# Altium schematic sheet AT24Cxxx_EEPROM_I2C.SchDoc
size A; SheetNumber: 5; SheetTotal: 12
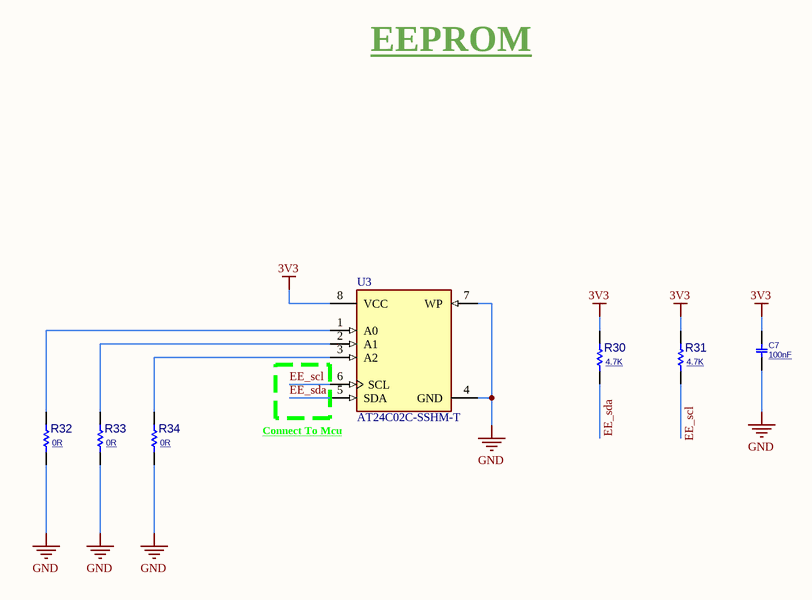
[diagram p0: AT24Cxxx_EEPROM_I2C.SchDoc]

## Parts
C7  100nF  [C0603]
R30  4.7K  [R0603]
R31  4.7K  [R0603]
R32  0R  [R0603]
R33  0R  [R0603]
R34  0R  [R0603]
U3  AT24C02C-SSHM-T  [FP-C04-057-SN-MFG]

## Nets
3V3: C7.2 R30.2 R31.2 U3.8(VCC)
GND: C7.1 R32.1 R33.1 R34.1 U3.4(GND) U3.7(WP)
EE_scl: R31.1 U3.6(SCL)
EE_sda: R30.1 U3.5(SDA)
NetR32_2: R32.2 U3.1(A0)
NetR33_2: R33.2 U3.2(A1)
NetR34_2: R34.2 U3.3(A2)

## Notes on the sheet
- EEPROM
- (near U3) Connect To Mcu

## Library data of the parts
C7 = CAP_SMD_MLCC_0603: CAP, MLCC, -F, -V, MATERIAL, -%, 0201; PARAM: -, -%; MANF_P#: MANF_PART#; PRICE: 100= 1$; MANF: -; PARAM2: -V; ASSEMBLY: ASSEMBLY; VALUE: 100nF
R30-R34 = RES_SMD: RESISTOR, SMD; PARAM: -W; DESC: DESCRIPTION; DIST#: MOUSER; PARAM2: 1%; MANF_P#: -; MANF: -; ASSEMBLY: ASSEMBLY; PRICE: 100= 0.5$
  R30 R31: VALUE: 4.7K
  R32-R34: VALUE: 0R
U3 = CMP-06313-000008-1: IC EEPROM 2K I2C 1MHZ 8SOIC; Manufacturer: Microchip; Frequency: 1000kHz; Nominal Supply Current: 0.4-2mA; Min Supply Voltage: 1.7V; Standoff Height: 0.1mm; Access Time: 900ns; Memory Size: 2Kbits; Max Supply Voltage: 5.5V; Interface: I2C,2-Wire; Ipc Land Pattern Name: SOIC127P600X175-8; Octopart: https://octopart.com/at24c02c-sshm-t-microchip-77757935; Footprint Url: http://ww1.microchip.com/downloads/en/DeviceDoc/08L_SOIC_150_3dot9mm_SN_C04-00057e.pdf; Temperature Range High: +85°C; Height: 1.75mm; Package: C04-057-SN; RoHS: TRUE; Mouser Description: EEPROM Serial-2Wire 2K-bit 256 x 8 1.8V/2.5V/3.3V/5V Automotive 8-Pin SOIC T/R; Memory Type: EEPROM; Device Class L3: EEPROM; Device Class L2: Memory; ComponentLink2URL: http://ww1.microchip.com/downloads/en/DeviceDoc/AT24C01C-AT24C02C-I2C-Compatible-Two-Wire-Serial-EEPROM-1Kbit-2Kbit-20006111A.pdf; Digikey Description: IC EEPROM 2K I2C 1MHZ 8SOIC; Category: IC; Temperature: -40°C to +85°C; Lead Free: Yes; Manufacturer Part Number: AT24C02C-SSHM-T; ComponentLink2Description: Datasheet; Temperature Range Low: -40°C; Automotive: No; Device Class L1: Integrated Circuits (ICs)